# EAGLE design 3AND_2 (EAGLE 6.5.0)
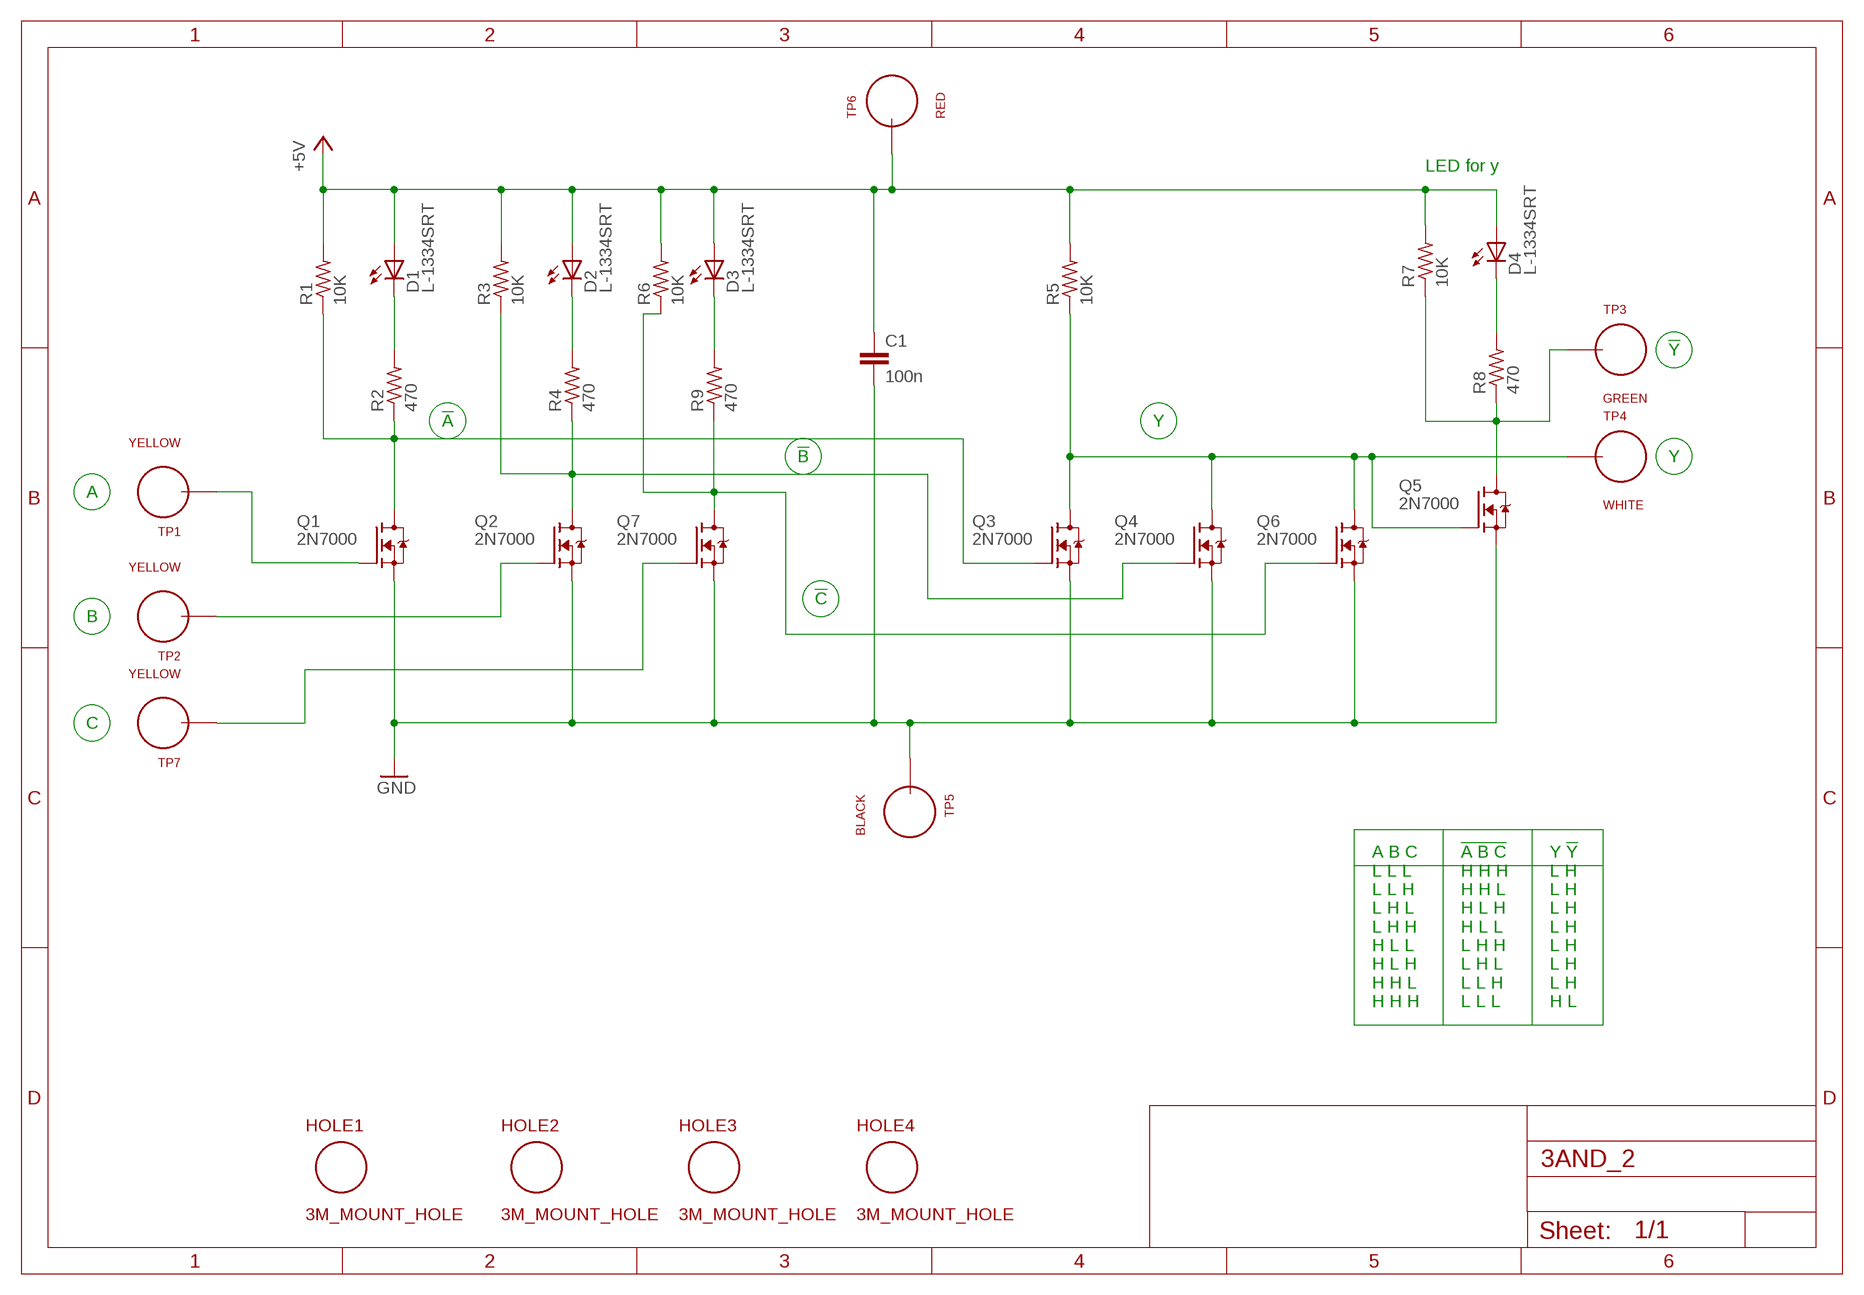
[diagram p0: schematic, sheet 1]

## Parts
C1  100n  C_P2INCH  [CAP_P2INCH]
D1  L-1334SRT  [LED3MM]
D2  L-1334SRT  [LED3MM]
D3  L-1334SRT  [LED3MM]
D4  L-1334SRT  [LED3MM]
HOLE1  3M_MOUNT_HOLE  [3M_HOLE]
HOLE2  3M_MOUNT_HOLE  [3M_HOLE]
HOLE3  3M_MOUNT_HOLE  [3M_HOLE]
HOLE4  3M_MOUNT_HOLE  [3M_HOLE]
Q1  2N7000  [TO92-DGS]
Q2  2N7000  [TO92-DGS]
Q3  2N7000  [TO92-DGS]
Q4  2N7000  [TO92-DGS]
Q5  2N7000  [TO92-DGS]
Q6  2N7000  [TO92-DGS]
Q7  2N7000  [TO92-DGS]
R1  10K  R_P2INCH  [R_P2INCH]
R2  470  R_P2INCH  [R_P2INCH]
R3  10K  R_P2INCH  [R_P2INCH]
R4  470  R_P2INCH  [R_P2INCH]
R5  10K  R_P2INCH  [R_P2INCH]
R6  10K  R_P2INCH  [R_P2INCH]
R7  10K  R_P2INCH  [R_P2INCH]
R8  470  R_P2INCH  [R_P2INCH]
R9  470  R_P2INCH  [R_P2INCH]
TP1  YELLOW  TEST_LOOP  [TEST_LOOP]
TP2  YELLOW  TEST_LOOP  [TEST_LOOP]
TP3  GREEN  TEST_LOOP  [TEST_LOOP]
TP4  WHITE  TEST_LOOP  [TEST_LOOP]
TP5  BLACK  TEST_LOOP  [TEST_LOOP]
TP6  RED  TEST_LOOP  [TEST_LOOP]
TP7  YELLOW  TEST_LOOP  [TEST_LOOP]

## Nets
+5V: C1.1 D1.A D2.A D3.A D4.A R1.2 R3.2 R5.2 R6.2 R7.2 TP6.P$1
GND: C1.2 Q1.S Q2.S Q3.S Q4.S Q5.S Q6.S Q7.S TP5.P$1
N$1: Q3.D Q4.D Q5.G Q6.D R5.1 TP4.P$1
N$2: D3.K(C) R9.2
N$3: D4.K(C) R8.2
N$4: Q5.D R7.1 R8.1 TP3.P$1
N$5: Q6.G Q7.D R6.1 R9.1
N$6: D2.K(C) R4.2
N$7: Q2.D Q4.G R3.1 R4.1
N$8: D1.K(C) R2.2
N$9: Q1.D Q3.G R1.1 R2.1
N$10: Q7.G TP7.P$1
N$11: Q1.G TP1.P$1
N$12: Q2.G TP2.P$1

## Notes on the sheet
- LED for y
- !Y
- !A | Y
- !B | Y
- A
- !C
- B
- C
- A B C
  L L L
  L L H
  L H L
  L H H
  H L L
  H L H
  H H L
  H H H
- !A B C
  H H H
  H H L
  H L H
  H L L
  L H H
  L H L
  L L H
  L L L
- Y !Y
  L H
  L H
  L H
  L H
  L H
  L H
  L H
  H L

## Library data of the parts
C1 = MyLib:C_P2INCH
D1-D4 = MyLib:L-1334SRT
HOLE1-HOLE4 = MyLib:3M_MOUNT_HOLE
Q1-Q7 = MyLib:2N7000
R1-R9 = MyLib:R_P2INCH
TP1-TP7 = MyLib:TEST_LOOP

## Board
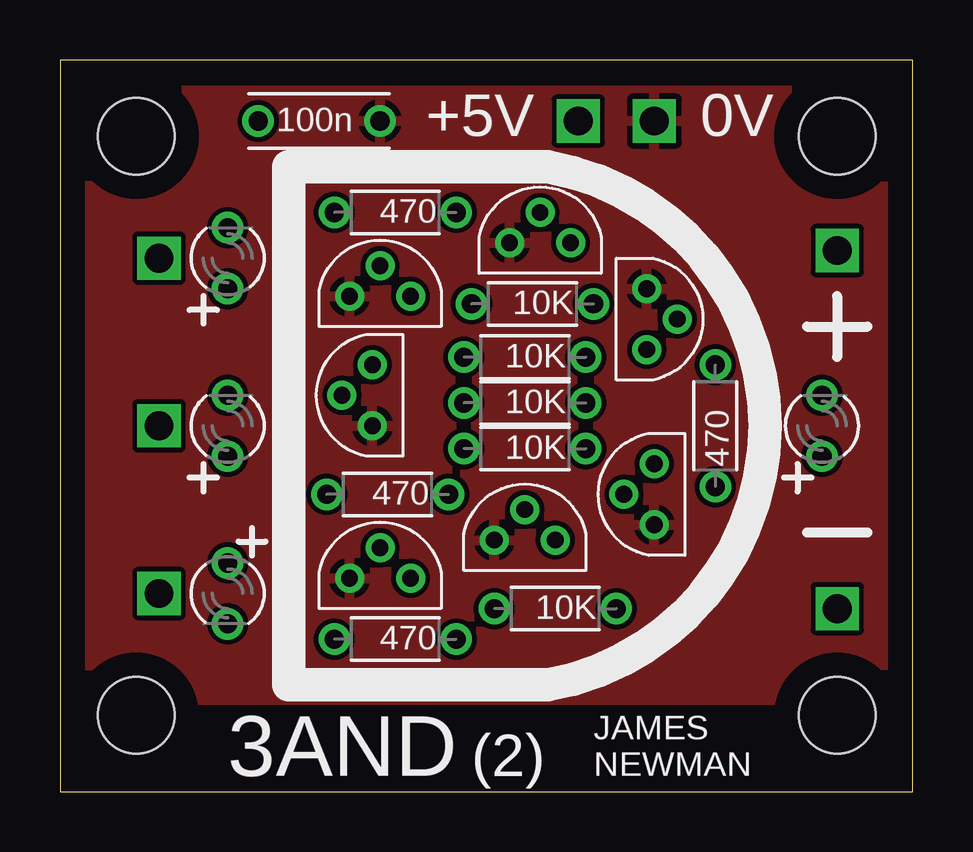
[diagram p1: board, top side]
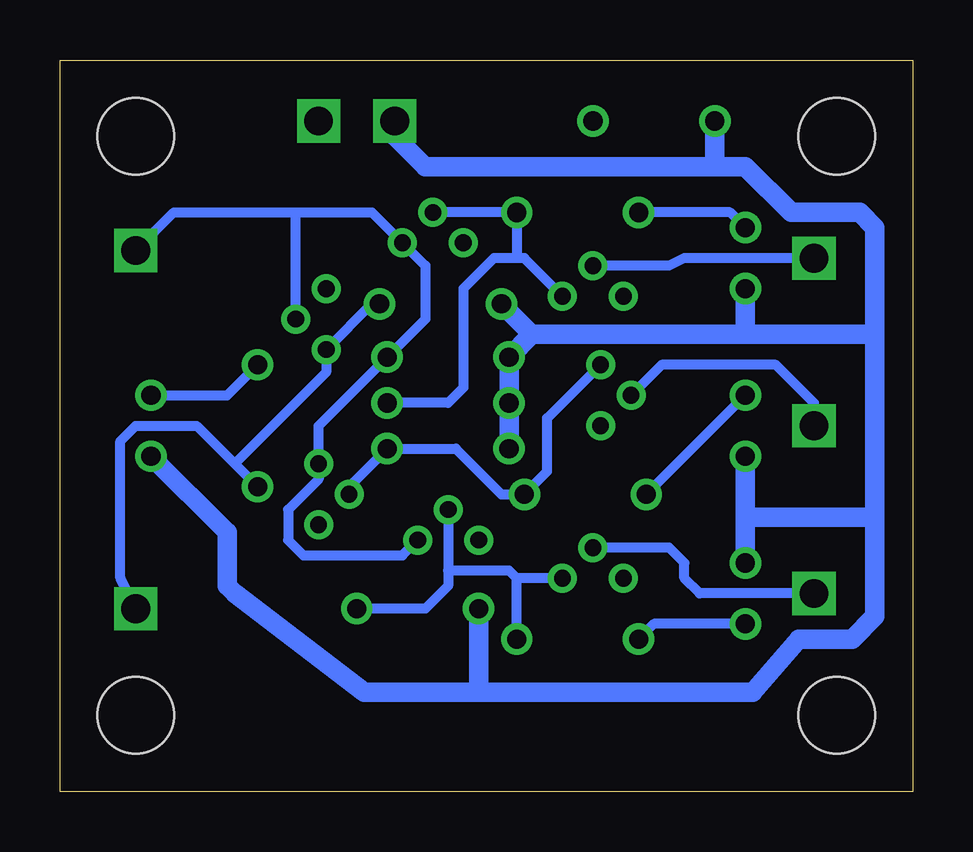
[diagram p2: board, bottom side, seen from below]

Size 35.54 x 30.48 mm. Coordinates in mm from the lower left corner, seen from the top.
Outline: 0,0 35.54,0 35.54,30.48 0,30.48 0,0
Copper layers (1*16): Top 0.035mm / dielectric 1.5mm / Bottom 0.035mm
Design rules "processor_rules *": minimum track width 10mil, minimum drill 0.0236mm, track to track 8mil, track to pad 8mil, pad to pad 8mil, via to via 8mil, smd to smd 8mil, copper to edge 40mil, drill to drill 8mil, minimum pad ring 10mil, minimum via ring 8mil, stop-mask expansion 4mil, vias tented up to drill 0.7mm, thermal gap 10mil

### Footprints (pad centres in the part's own frame; a part is rotated, then mirrored left to right if it is on the bottom)
CAP_P2INCH = drill 0.8: 1 -2.54,0; 2 2.54,0
LED3MM = drill 0.8: A -1.27,0; K 1.27,0
3M_HOLE = hole 3.2: 0,0
TO92-DGS = drill 0.7: D 0,1.27; G -1.27,0; S 0,-1.27
R_P2INCH = drill 0.8: 1 -2.54,0; 2 2.54,0
TEST_LOOP = drill 1.2 square: P$1 0,0

### Placement (x,y rotation side)
C1  10.79,27.94 0 top
D1  6.99,22.23 90 top
D2  6.99,8.26 270 top
D3  6.99,15.24 90 top
D4  31.75,15.24 90 top
HOLE1  3.17,3.17 0 top
HOLE2  3.17,27.3 0 top
HOLE3  32.38,3.17 0 top
HOLE4  32.38,27.3 0 top
Q1  13.34,20.64 270 top
Q2  13.34,8.89 270 top
Q3  20,22.86 270 top
Q4  19.37,10.48 270 top
Q5  24.45,19.68 180 top
Q6  24.77,12.38 0 top
Q7  13.02,16.51 0 top
R1  19.37,16.19 180 top
R2  13.97,24.13 180 top
R3  20.64,7.62 180 top
R4  13.97,6.35 180 top
R5  19.37,18.1 180 top
R6  19.37,14.29 180 top
R7  19.68,20.32 180 top
R8  27.3,15.24 90 top
R9  13.65,12.38 180 top
TP1  4.13,22.23 0 top
TP2  4.13,8.26 0 top
TP3  32.38,7.62 0 top
TP4  32.38,22.54 0 top
TP5  24.77,27.94 0 top
TP6  21.59,27.94 0 top
TP7  4.13,15.24 0 top

### Tracks (layer width: path | path; a pad name or v marks a point on that pad's centre or on a via)
+5V
  Bottom 0.813: 8.26,26.04 20.32,26.04 21.59,27.3 TP6.P$1 | 8.26,26.04 6.99,26.04 5.08,24.13 2.22,24.13 1.59,23.5 1.59,19.05 | D1.A 6.99,19.05 | 1.59,19.05 6.99,19.05 | 18.1,4.13 22.86,4.13 28.26,8.26 28.57,8.57 28.57,10.79 D4.A | 18.1,4.13 6.67,4.13 4.76,6.35 2.54,6.35 1.59,7.3 1.59,11.43 | 1.59,11.43 1.59,19.05 | 15.88,19.05 6.99,19.05 | D2.A 6.99,11.43 | 6.99,11.43 1.59,11.43 | D3.A 6.99,11.43 | R3.2 18.1,4.13 | 15.88,19.05 R7.2 | 15.88,19.05 R5.2 R1.2 R6.2 | C1.1 8.26,26.04
GND
  pour Top: 1.27,29.21 34.29,29.21 34.29,3.81 1.27,3.81
N$1
  Bottom 0.406: TP4.P$1 30.8,24.13 25.72,24.13 | 25.72,24.13 22.54,24.13 Q3.D 20.32,21.91 20.32,19.68 R5.1 24.77,15.24 Q6.D 24.77,13.02 26.04,11.75 26.04,10.48 25.4,9.84 21.27,9.84 Q4.D | Q5.G 25.72,24.13
N$2
  Bottom 0.406: D3.K R9.2
N$3
  Bottom 0.406: D4.K 28.57,16.51 R8.2
N$4
  Bottom 0.406: TP3.P$1 33.02,8.89 33.02,14.61 32.38,15.24 29.84,15.24 28.26,13.65 | 28.26,13.65 R8.1 | R7.1 22.54,20.32 Q5.D 24.45,17.46 28.26,13.65
N$5
  Bottom 0.406: Q7.D 15.24,15.56 15.24,13.34 R9.1 17.14,12.38 19.05,14.29 R6.1 23.5,12.7 Q6.G
N$6
  Bottom 0.406: D2.K 10.79,6.99 R4.2
N$7
  Bottom 0.406: Q4.G 19.37,9.21 | 19.37,9.21 19.37,8.57 20.32,7.62 R3.1 | Q2.D 16.51,8.89 | 16.51,8.89 16.83,9.21 19.37,9.21 | R4.1 16.51,8.89
N$8
  Bottom 0.406: D1.K 7.62,24.13 R2.2
N$9
  Bottom 0.406: Q1.D 16.19,22.23 16.51,22.23 | 16.51,22.23 R2.1 Q3.G | 16.51,22.23 17.46,22.23 18.73,20.95 18.73,16.83 19.37,16.19 R1.1
N$10
  Bottom 0.406: TP7.P$1 4.13,16.19 5.71,17.78 10.48,17.78 Q7.G
N$11
  Bottom 0.406: TP1.P$1 9.53,22.23 10.16,21.91 Q1.G
N$12
  Bottom 0.406: TP2.P$1 8.89,8.26 9.53,8.89 9.53,9.53 10.16,10.16 Q2.G

### Text on the board
tPlace: +5V | 0V | 3AND | (2) | JAMES / NEWMAN